# Altium schematic sheet SH06-UI.SchDoc
size A4
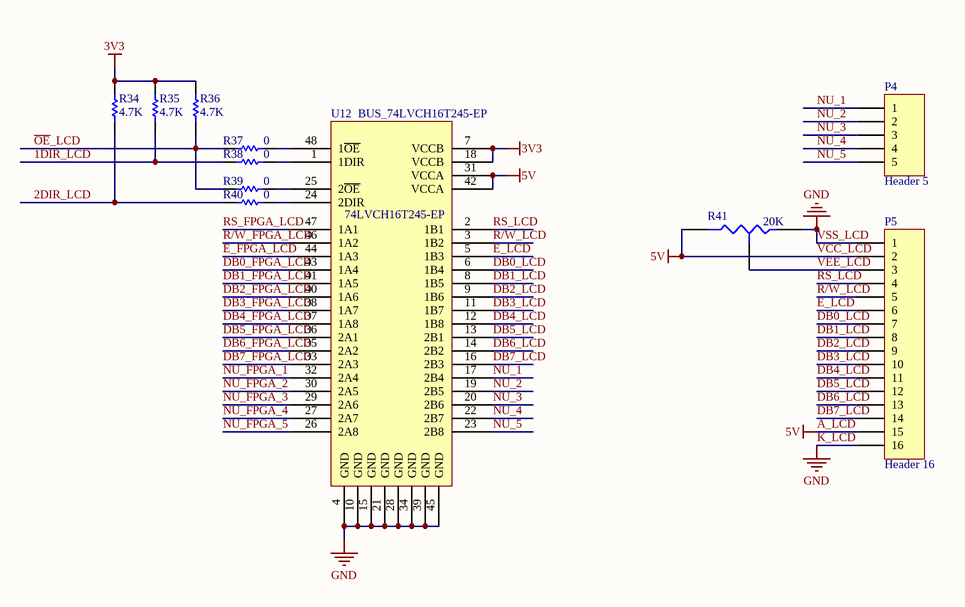
[diagram p0: SH06-UI.SchDoc]

## Parts
P4  Header 5  [HDR1X5]
P5  Header 16  [HDR1X16]
R34  value 4.7K  [1608[0603]]  (hidden comment: Res,4.7K/0603)
R35  value 4.7K  [1608[0603]]  (hidden comment: Res,4.7K/0603)
R36  value 4.7K  [1608[0603]]  (hidden comment: Res,4.7K/0603)
R37  value 0  [1608[0603]]  (hidden comment: Res,0R/0603)
R38  value 0  [1608[0603]]  (hidden comment: Res,0R/0603)
R39  value 0  [1608[0603]]  (hidden comment: Res,0R/0603)
R40  value 0  [1608[0603]]  (hidden comment: Res,0R/0603)
R41  value 20K  [RES-adj]  (hidden comment: Res Adj,20K)
U12  BUS_74LVCH16T245-EP  [TSSOP50P810X120-48N]

## Nets
3V3: R34.2 R35.2 R36.2 U12.7(VCCB) U12.18(VCCB)
A_LCD: P5.2 P5.15 R41.2(B) U12.31(VCCA) U12.42(VCCA)  [also labelled 5V, VCC_LCD]
K_LCD: P5.1 P5.16 R41.1(A) U12.4(GND) U12.10(GND) U12.15(GND) U12.21(GND) U12.28(GND) U12.34(GND) U12.39(GND) U12.45(GND)  [also labelled GND, VSS_LCD]
1DIR_LCD: R35.1 R38.1
2DIR_LCD: R34.1 R40.1
DB0_FPGA_LCD: U12.43(1A4)
DB0_LCD: P5.7 U12.6(1B4)
DB1_FPGA_LCD: U12.41(1A5)
DB1_LCD: P5.8 U12.8(1B5)
DB2_FPGA_LCD: U12.40(1A6)
DB2_LCD: P5.9 U12.9(1B6)
DB3_FPGA_LCD: U12.38(1A7)
DB3_LCD: P5.10 U12.11(1B7)
DB4_FPGA_LCD: U12.37(1A8)
DB4_LCD: P5.11 U12.12(1B8)
DB5_FPGA_LCD: U12.36(2A1)
DB5_LCD: P5.12 U12.13(2B1)
DB6_FPGA_LCD: U12.35(2A2)
DB6_LCD: P5.13 U12.14(2B2)
DB7_FPGA_LCD: U12.33(2A3)
DB7_LCD: P5.14 U12.16(2B3)
E_FPGA_LCD: U12.44(1A3)
E_LCD: P5.6 U12.5(1B3)
NU_1: P4.1 U12.17(2B4)
NU_2: P4.2 U12.19(2B5)
NU_3: P4.3 U12.20(2B6)
NU_4: P4.4 U12.22(2B7)
NU_5: P4.5 U12.23(2B8)
NU_FPGA_1: U12.32(2A4)
NU_FPGA_2: U12.30(2A5)
NU_FPGA_3: U12.29(2A6)
NU_FPGA_4: U12.27(2A7)
NU_FPGA_5: U12.26(2A8)
~{OE}_LCD: R36.1 R37.1 R39.1
R/W_FPGA_LCD: U12.46(1A2)
R/W_LCD: P5.5 U12.3(1B2)
RS_FPGA_LCD: U12.47(1A1)
RS_LCD: P5.4 U12.2(1B1)
VEE_LCD: P5.3 R41.3(TAP)
NetR37_2: R37.2 U12.48(1~{OE})
NetR38_2: R38.2 U12.1(1DIR)
NetR39_2: R39.2 U12.25(2~{OE})
NetR40_2: R40.2 U12.24(2DIR)

## Notes on the sheet
- (in symbol BUS_74LVCH16T245-EP) 74LVCH16T245-EP

## Library data of the parts
P4 = Header 5: Header, 5-Pin; LatestRevisionDate: 17-Jul-2002; LatestRevisionNote: Re-released for DXP Platform.; Publisher: Altium Limited
P5 = Header 16: Header, 16-Pin; LatestRevisionDate: 17-Jul-2002; LatestRevisionNote: Re-released for DXP Platform.; Publisher: Altium Limited
R34-R40 = Res1: Resistor; Published: 8-Jun-2000; LatestRevisionDate: 17-Jul-2002; LatestRevisionNote: Re-released for DXP Platform.; PackageReference: AXIAL-0.3; Publisher: Altium Limited
R41 = Res Tap: Tapped Resistor; Sim Note: Enter the Resistance value and the set point into parameter fields.; Set Position: 0.5; Published: 24-Mar-1999; LatestRevisionDate: 17-Jul-2002; LatestRevisionNote: Re-released for DXP Platform.; PackageReference: VR3; Publisher: Altium Limited